# EAGLE schematic SparkFun_SARA-R5_Breakout (EAGLE 9.6.2)
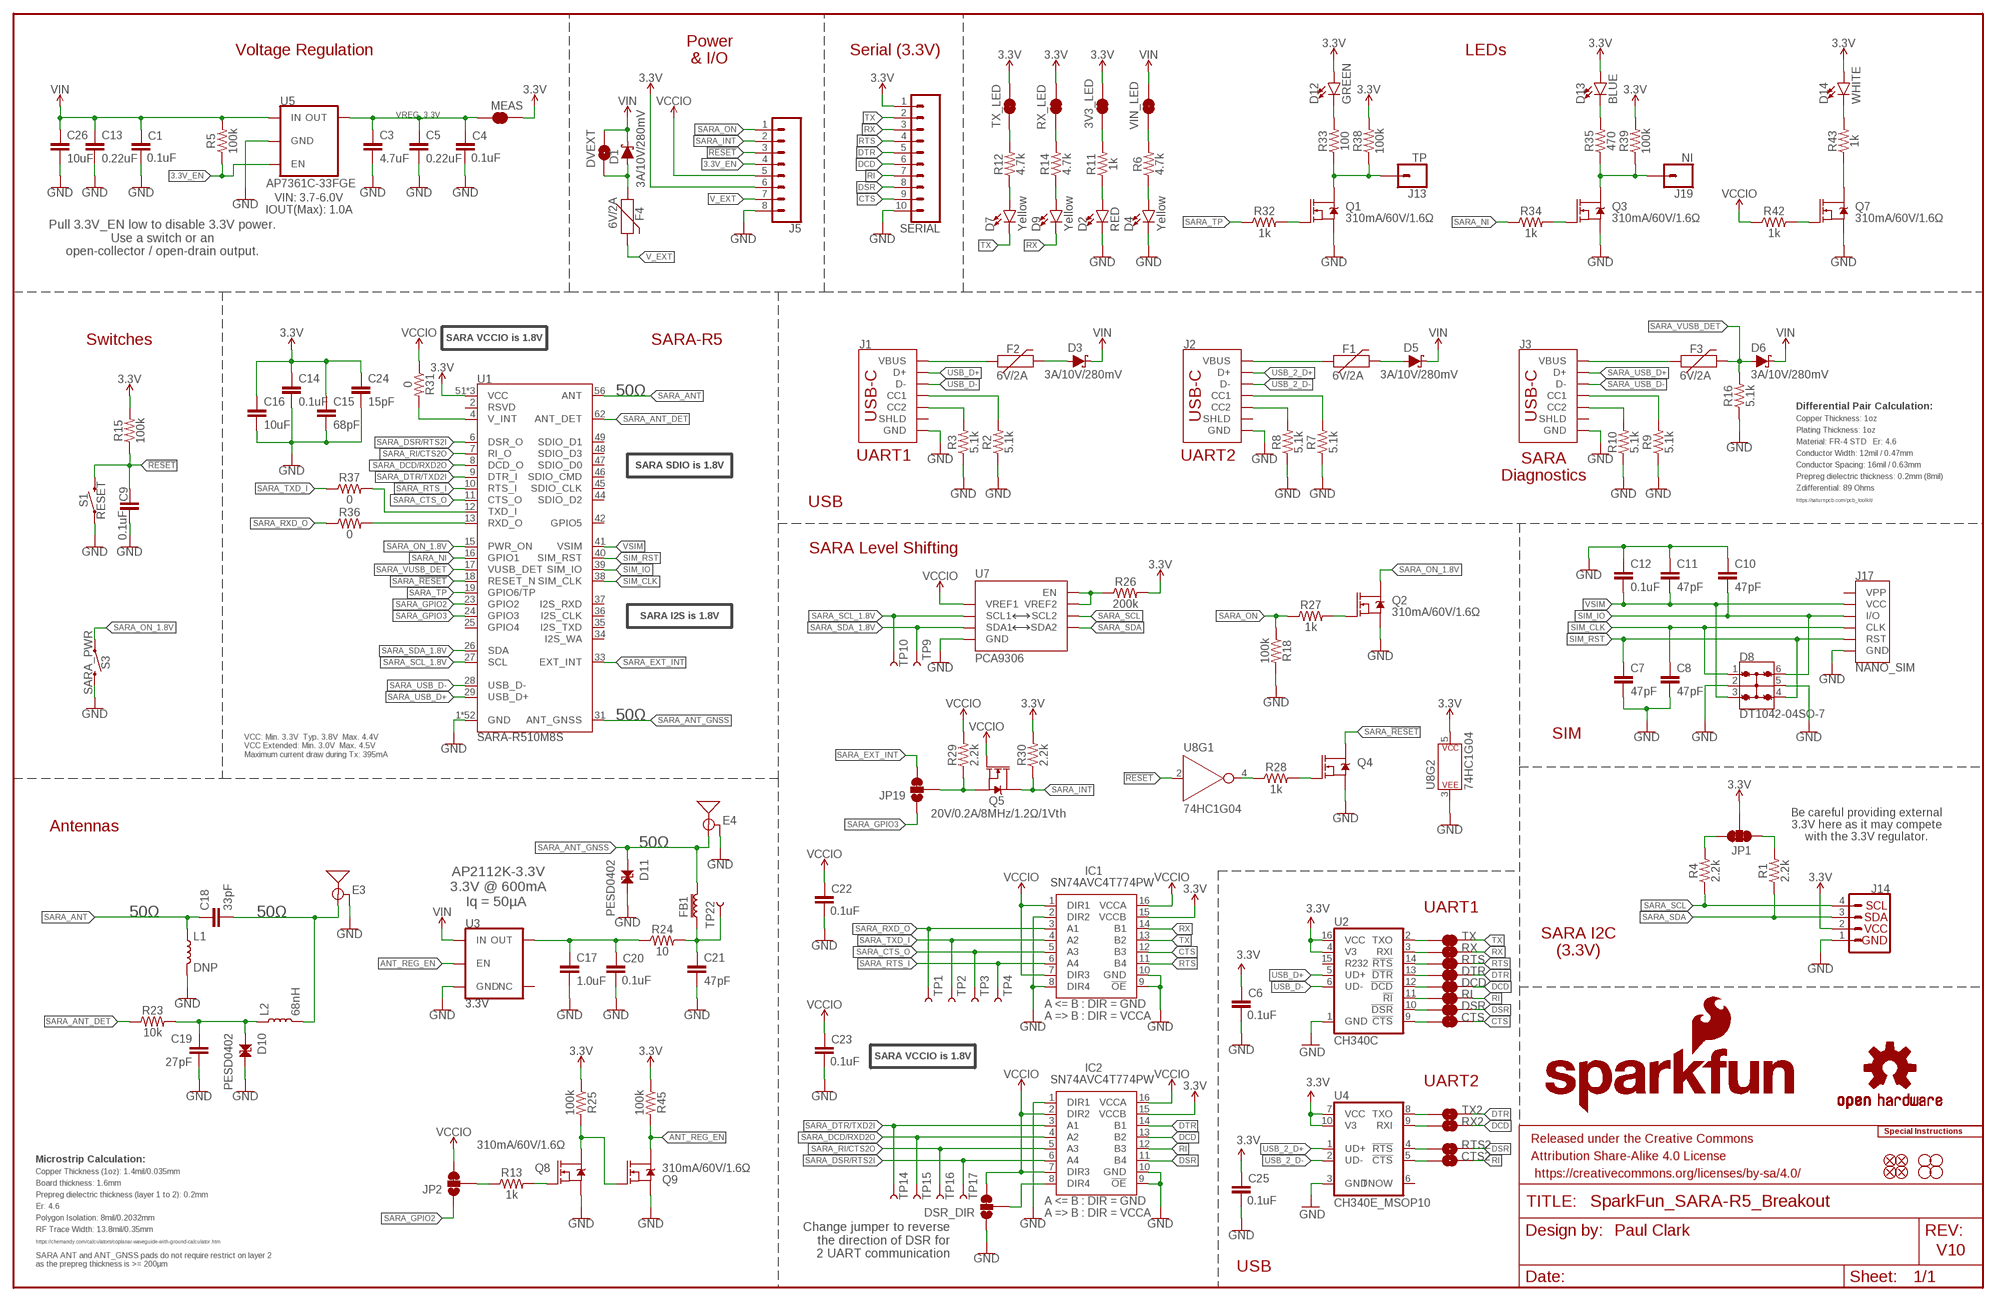
[diagram p0: schematic, sheet 1]

## Parts
3V3_LED  JUMPER-SMT_2_NC_TRACE_SILK  [SMT-JUMPER_2_NC_TRACE_SILK]
C1  0.1uF  0.1UF-0603-25V-5%  [0603]
C3  4.7uF  4.7UF-0603-6.3V-(10%)  [0603]
C4  0.1uF  0.1UF-0603-25V-5%  [0603]
C5  0.22uF  0.22UF-0603-25V-10%  [0603]
C6  0.1uF  0.1UF-0603-25V-5%  [0603]
C7  47pF  47PF-0603-50V-5%  [0603]
C8  47pF  47PF-0603-50V-5%  [0603]
C9  0.1uF  0.1UF-0603-25V-5%  [0603]
C10  47pF  47PF-0603-50V-5%  [0603]
C11  47pF  47PF-0603-50V-5%  [0603]
C12  0.1uF  0.1UF-0603-25V-5%  [0603]
C13  0.22uF  0.22UF-0603-25V-10%  [0603]
C14  0.1uF  0.1UF-0603-25V-5%  [0603]
C15  68pF  68PF-0603-50V-5%  [0603]
C16  10uF  10UF-0603-6.3V-20%  [0603]
C17  1.0uF  1.0UF-0603-16V-10%  [0603]
C18  33pF  33PF-0402-25V-5%-X7R  [0402]
C19  27pF  27PF-0402-25V-5%-X7R  [0402]
C20  0.1uF  0.1UF-0603-25V-5%  [0603]
C21  47pF  47PF-0603-50V-5%  [0603]
C22  0.1uF  0.1UF-0603-25V-5%  [0603]
C23  0.1uF  0.1UF-0603-25V-5%  [0603]
C24  15pF  15PF-0603-50V-5%  [0603]
C25  0.1uF  0.1UF-0603-25V-5%  [0603]
C26  10uF  10UF-0805-25V-10%  [0805]
CTS  JUMPER-SMT_2_NC_TRACE_SILK  [SMT-JUMPER_2_NC_TRACE_SILK]
CTS2  JUMPER-SMT_2_NO_SILK  [SMT-JUMPER_2_NO_SILK]
D1  3A/10V/280mV  DIODE-SCHOTTKY-BAT60A  [SOD-323]
D2  RED  LED-RED0603  [LED-0603]
D3  3A/10V/280mV  DIODE-SCHOTTKY-BAT60A  [SOD-323]
D4  Yellow  LED-YELLOW0603  [LED-0603]
D5  3A/10V/280mV  DIODE-SCHOTTKY-BAT60A  [SOD-323]
D6  3A/10V/280mV  DIODE-SCHOTTKY-BAT60A  [SOD-323]
D7  Yellow  LED-YELLOW0603  [LED-0603]
D8  DT1042-04SO-7  TVS_DIODE_ARRAY_4DT1042-04SO-7  [SOT23-6L]
D9  Yellow  LED-YELLOW0603  [LED-0603]
D10  PESD0402  [0402]
D11  PESD0402  [0402]
D12  GREEN  LED-GREEN0603  [LED-0603]
D13  BLUE  LED-BLUE0603  [LED-0603]
D14  WHITE  LED-WHITE0603  [LED-0603]
DCD  JUMPER-SMT_2_NC_TRACE_SILK  [SMT-JUMPER_2_NC_TRACE_SILK]
DSR  JUMPER-SMT_2_NC_TRACE_SILK  [SMT-JUMPER_2_NC_TRACE_SILK]
DSR_DIR  JUMPER-SMT_3_1-NC_TRACE_SILK  [SMT-JUMPER_3_1-NC_TRACE_SILK]
DTR  JUMPER-SMT_2_NC_TRACE_SILK  [SMT-JUMPER_2_NC_TRACE_SILK]
DVEXT  JUMPER-SMT_2_NO_SILK  [SMT-JUMPER_2_NO_SILK]
E3  ANTENNA-SMA-GROUNDEDEDGE_SMA_SMD  [SMA-EDGE-SMD]
E4  ANTENNA-SMA-GROUNDEDEDGE_SMA_SMD  [SMA-EDGE-SMD]
F1  6V/2A  PPTC_6V2A  [1210]
F2  6V/2A  PPTC_6V2A  [1210]
F3  6V/2A  PPTC_6V2A  [1210]
F4  6V/2A  PPTC_6V2A  [1210]
FB1  30Ω/1.8A  FERRITE_BEAD-0603  [0603]
FD1  FIDUCIALUFIDUCIAL  [FIDUCIAL-MICRO]
FD2  FIDUCIALUFIDUCIAL  [FIDUCIAL-MICRO]
FD3  FIDUCIALUFIDUCIAL  [FIDUCIAL-MICRO]
FD4  FIDUCIALUFIDUCIAL  [FIDUCIAL-MICRO]
FRAME1  FRAME-LEDGER  [CREATIVE_COMMONS]
H1  STAND-OFF  [STAND-OFF]
H2  STAND-OFF  [STAND-OFF]
H3  STAND-OFF  [STAND-OFF]
H4  STAND-OFF  [STAND-OFF]
IC1  SN74AVC4T774PW  [SOP65P640X120-16N]
IC2  SN74AVC4T774PW  [SOP65P640X120-16N]
J1  USB_C_4-LAYER_PADS  [USB-C-16P_4LAYER-PADS]
J2  USB_C_4-LAYER_PADS  [USB-C-16P_4LAYER-PADS]
J3  USB_C_4-LAYER_PADS  [USB-C-16P_4LAYER-PADS]
J5  CONN_08NO_SILK_DNP  [1X08_NO_SILK]
J13  TP  CONN_01PTH_NO_SILK_YES_STOP  [1X01_NO_SILK]
J14  I2C_STANDARD_NO_SILK  [1X04_NO_SILK]
J17  NANO_SIM  SIMHOLDERNANOSIM  [NANO_SIM_WURTH_693043020611]
J19  NI  CONN_01PTH_NO_SILK_YES_STOP  [1X01_NO_SILK]
JP1  JUMPER-SMT_3_2-NC_TRACE_SILK  [SMT-JUMPER_3_2-NC_TRACE_SILK]
JP2  JUMPER-SMT_3_1-NC_TRACE_SILK  [SMT-JUMPER_3_1-NC_TRACE_SILK]
JP19  JUMPER-SMT_3_1-NC_TRACE_SILK  [SMT-JUMPER_3_1-NC_TRACE_SILK]
L1  DNP  INDUCTOR_DNP-0402  [0402_COILCRAFT]
L2  68nH  68NH-0402  [0402_COILCRAFT]
LOGO1  SFE_LOGO_NAME_FLAME.1_INCH  [SFE_LOGO_NAME_FLAME_.1]
LOGO3  OSHW-LOGOMINI  [OSHW-LOGO-MINI]
LOGO5  SPECIAL_INSTRUCTIONS-ORDERING  [ORDERING_INSTRUCTIONS]
MEAS  JUMPER-COMBO_2_NC_TRACE  [COMBO-JUMPER_2_NC_TRACE]
Q1  310mA/60V/1.6Ω  MOSFET-NCH-2N7002PW  [SOT323]
Q2  310mA/60V/1.6Ω  MOSFET-NCH-2N7002PW  [SOT323]
Q3  310mA/60V/1.6Ω  MOSFET-NCH-2N7002PW  [SOT323]
Q4  310mA/60V/1.6Ω  MOSFET-NCH-2N7002PW  [SOT323]
Q5  20V/0.2A/8MHz/1.2Ω/1Vth  MOSFET-NCH-RE1C00UNTL  [SOT-416FL]
Q7  310mA/60V/1.6Ω  MOSFET-NCH-2N7002PW  [SOT323]
Q8  310mA/60V/1.6Ω  MOSFET-NCH-2N7002PW  [SOT323]
Q9  310mA/60V/1.6Ω  MOSFET-NCH-2N7002PW  [SOT323]
R1  2.2k  2.2KOHM-0603-1/10W-1%  [0603]
R2  5.1k  5.1KOHM5.1KOHM-0603-1/10W-1%  [0603]
R3  5.1k  5.1KOHM5.1KOHM-0603-1/10W-1%  [0603]
R4  2.2k  2.2KOHM-0603-1/10W-1%  [0603]
R5  100k  100KOHM-0603-1/10W-1%  [0603]
R6  4.7k  4.7KOHM-0603-1/10W-1%  [0603]
R7  5.1k  5.1KOHM5.1KOHM-0603-1/10W-1%  [0603]
R8  5.1k  5.1KOHM5.1KOHM-0603-1/10W-1%  [0603]
R9  5.1k  5.1KOHM5.1KOHM-0603-1/10W-1%  [0603]
R10  5.1k  5.1KOHM5.1KOHM-0603-1/10W-1%  [0603]
R11  1k  1KOHM-0603-1/10W-1%  [0603]
R12  4.7k  4.7KOHM-0603-1/10W-1%  [0603]
R13  1k  1KOHM-0603-1/10W-1%  [0603]
R14  4.7k  4.7KOHM-0603-1/10W-1%  [0603]
R15  100k  100KOHM-0603-1/10W-1%  [0603]
R16  5.1k  5.1KOHM5.1KOHM-0603-1/10W-1%  [0603]
R18  100k  100KOHM-0603-1/10W-1%  [0603]
R23  10k  10KOHM-0603-1/10W-1%  [0603]
R24  10  10OHM-0603-1/10W-1%  [0603]
R25  100k  100KOHM-0603-1/10W-1%  [0603]
R26  200k  200KOHM-0603-1/10W-1%  [0603]
R27  1k  1KOHM-0603-1/10W-1%  [0603]
R28  1k  1KOHM-0603-1/10W-1%  [0603]
R29  2.2k  2.2KOHM-0603-1/10W-1%  [0603]
R30  2.2k  2.2KOHM-0603-1/10W-1%  [0603]
R31  0  0OHM-0603-1/10W  [0603]
R32  1k  1KOHM-0603-1/10W-1%  [0603]
R33  100  100OHM-0603-1/10W-1%  [0603]
R34  1k  1KOHM-0603-1/10W-1%  [0603]
R35  470  470OHM-0603-1/10W-1%  [0603]
R36  0  0OHM-0603-1/10W  [0603]
R37  0  0OHM-0603-1/10W  [0603]
R38  100k  100KOHM-0603-1/10W-1%  [0603]
R39  100k  100KOHM-0603-1/10W-1%  [0603]
R42  1k  1KOHM-0603-1/10W-1%  [0603]
R43  1k  1KOHM-0603-1/10W-1%  [0603]
R45  100k  100KOHM-0603-1/10W-1%  [0603]
RI  JUMPER-SMT_2_NC_TRACE_SILK  [SMT-JUMPER_2_NC_TRACE_SILK]
RTS  JUMPER-SMT_2_NC_TRACE_SILK  [SMT-JUMPER_2_NC_TRACE_SILK]
RTS2  JUMPER-SMT_2_NO_SILK  [SMT-JUMPER_2_NO_SILK]
RX  JUMPER-SMT_2_NC_TRACE_SILK  [SMT-JUMPER_2_NC_TRACE_SILK]
RX2  JUMPER-SMT_2_NO_SILK  [SMT-JUMPER_2_NO_SILK]
RX_LED  JUMPER-SMT_2_NC_TRACE_SILK  [SMT-JUMPER_2_NC_TRACE_SILK]
S1  RESET  MOMENTARY-SWITCH-SPST-SMD-5.2-TALL-REDUNDANT  [TACTILE_SWITCH_SMD_5.2MM]
S3  SARA_PWR  MOMENTARY-SWITCH-SPST-SMD-5.2-TALL-REDUNDANT  [TACTILE_SWITCH_SMD_5.2MM]
SERIAL  CONN_10NO_SILK_PTH_FEMALE  [1X10_NO_SILK]
TP1  TEST-POINT3  [PAD.03X.03]
TP2  TEST-POINT3  [PAD.03X.03]
TP3  TEST-POINT3  [PAD.03X.03]
TP4  TEST-POINT3  [PAD.03X.03]
TP9  TEST-POINT3  [PAD.03X.03]
TP10  TEST-POINT3  [PAD.03X.03]
TP14  TEST-POINT3  [PAD.03X.03]
TP15  TEST-POINT3  [PAD.03X.03]
TP16  TEST-POINT3  [PAD.03X.03]
TP17  TEST-POINT3  [PAD.03X.03]
TP22  TEST-POINT3  [PAD.03X.03]
TX  JUMPER-SMT_2_NC_TRACE_SILK  [SMT-JUMPER_2_NC_TRACE_SILK]
TX2  JUMPER-SMT_2_NO_SILK  [SMT-JUMPER_2_NO_SILK]
TX_LED  JUMPER-SMT_2_NC_TRACE_SILK  [SMT-JUMPER_2_NC_TRACE_SILK]
U1  SARA-R510M8S  [SARA-LGA]
U2  CH340C  [SO016]
U3  3.3V  V_REG_AP2112K-3.3V  [SOT23-5]
U4  CH340E_MSOP10  [MSOP10]
U5  AP7361C-33FGE  AP7361C-33FGEUDFN-8  [UDFN-8]
U7  PCA9306  PCA9306VSSOP_8PIN  [VSSOP_8PIN]
U8  74HC1G04  [SOT353]
VIN_LED  JUMPER-SMT_2_NC_TRACE_SILK  [SMT-JUMPER_2_NC_TRACE_SILK]

## Nets
3.3V: 3V3_LED.2 C6.1 C14.1 C15.1 C16.1 C24.1 C25.1 D12.A D13.A D14.A IC1.15(VCCB) IC2.15(VCCB) J5.6 J14.2 JP1.2 MEAS.2 MEAS.4 R15.2 R25.1 R26.2 R30.2 R38.2 R39.2 R45.1 RX_LED.2 SERIAL.1 TX_LED.2 U1.51(VCC) U1.52(VCC) U1.53(VCC) U2.4(V3) U2.16(VCC) U4.7(VCC) U4.10(V3) U8.5(P$V+)
3.3V_EN: J5.4 R5.1 U5.5(EN)
!RESET!: C9.1 J5.3 R15.1 S1.3 S1.4 U8.2(A)
ANT_REG_EN: Q9.3(D) R45.2 U3.3(EN)
CTS: CTS.2 IC1.12(B3) SERIAL.9
DCD: DCD.2 IC2.13(B2) RX2.2 SERIAL.6
DSR: DSR.2 IC2.11(B4) RTS2.2 SERIAL.8
DTR: DTR.2 IC2.14(B1) SERIAL.5 TX2.2
GND: C1.2 C3.2 C4.2 C5.2 C6.2 C7.2 C8.2 C9.2 C10.1 C11.1 C12.1 C13.2 C14.2 C15.2 C16.2 C17.2 C19.2 C20.2 C21.2 C22.2 C23.2 C24.2 C25.2 C26.2 D2.C D4.C D8.2 D8.5 D10.2 D11.2 DSR_DIR.1 E3.GND@0(GND) E3.GND@1(GND) E4.GND@0(GND) E4.GND@1(GND) IC1.2(DIR2) IC1.8(DIR4) IC1.9(!OE) IC1.10(GND) IC2.1(DIR1) IC2.9(!OE) IC2.10(GND) J1.GND J1.GND2(GND) J2.GND J2.GND2(GND) J3.GND J3.GND2(GND) J5.8 J14.1 J17.C5(GND) L1.P$2 Q1.2(S) Q2.2(S) Q3.2(S) Q4.2(S) Q7.2(S) Q8.2(S) Q9.2(S) R2.1 R3.1 R7.1 R8.1 R9.1 R10.1 R16.1 R18.2 S1.1 S1.2 S3.3 S3.4 SERIAL.10 U1.1(GND) U1.3(GND) U1.5(GND) U1.14(GND) U1.20(GND) U1.21(GND) U1.22(GND) U1.30(GND) U1.32(GND) U1.43(GND) U1.50(GND) U1.54(GND) U1.55(GND) U1.57(GND) U1.58(GND) U1.59(GND) U1.60(GND) U1.61(GND) U1.63(GND) U1.64(GND) U1.65(GND) U1.66(GND) U1.67(GND) U1.68(GND) U1.69(GND) U1.70(GND) U1.71(GND) U1.72(GND) U1.73(GND) U1.74(GND) U1.75(GND) U1.76(GND) U1.77(GND) U1.78(GND) U1.79(GND) U1.80(GND) U1.81(GND) U1.82(GND) U1.83(GND) U1.84(GND) U1.85(GND) U1.86(GND) U1.87(GND) U1.88(GND) U1.89(GND) U1.90(GND) U1.91(GND) U1.92(GND) U1.93(GND) U1.94(GND) U1.95(GND) U1.96(GND) U2.1(GND) U3.2(GND) U4.3(GND) U5.4(GND) U5.EP(GND) U7.P1(GND) U8.3(P$V-)
N$1: R6.2 VIN_LED.1
N$2: JP1.3 R4.2
N$3: JP1.1 R1.2
N$4: D3.A F2.2
N$5: J2.A5(CC1) R7.2
N$6: 3V3_LED.1 R11.2
N$7: D2.A R11.1
N$8: D4.A R6.1
N$9: J2.B5(CC2) R8.2
N$10: J1.A5(CC1) R2.2
N$11: J1.B5(CC2) R3.2
N$12: D5.A F1.2
N$13: F1.1 J2.VBUS1(VBUS) J2.VBUS2(VBUS)
N$14: J3.A5(CC1) R9.2
N$15: C18.2 E3.SIG(SIGNAL) L2.P$2
N$16: C19.1 D10.1 L2.P$1 R23.2
N$17: J3.B5(CC2) R10.2
N$18: F3.1 J3.VBUS1(VBUS) J3.VBUS2(VBUS)
N$19: F2.1 J1.VBUS1(VBUS) J1.VBUS2(VBUS)
N$20: TX.1 U2.2(TXO)
N$21: RX.1 U2.3(RXI)
N$22: R26.1 U7.P7(VREF2) U7.P8(EN)
N$23: DSR_DIR.2 IC2.8(DIR4)
N$24: C17.1 C20.1 R24.1 U3.5(OUT)
N$25: C21.1 FB1.1 R24.2 TP22.P$1
N$26: Q2.1(G) R27.2
N$27: Q4.1(G) R28.2
N$28: R28.1 U8.4(Y)
N$29: RTS.1 U2.14(!RTS)
N$30: DTR.1 U2.13(!DTR)
N$31: R31.2 U1.4(V_INT)
N$32: Q1.1(G) R32.2
N$33: J13.1 Q1.3(D) R33.1 R38.1
N$34: D12.C R33.2
N$35: Q3.1(G) R34.2
N$36: J19.1 Q3.3(D) R35.1 R39.1
N$37: D13.C R35.2
N$38: R36.2 U1.13(RXD_O)
N$39: R37.2 U1.12(TXD_I)
N$40: Q8.1(G) R13.2
N$41: DCD.1 U2.12(!DCD)
N$42: Q8.3(D) Q9.1(G) R25.2
N$43: JP19.2 Q5.2(S) R29.1
N$44: RI.1 U2.11(!RI)
N$45: DSR.1 U2.10(!DSR)
N$46: CTS.1 U2.9(!CTS)
N$47: Q7.1(G) R42.2
N$48: TX2.1 U4.8(TXO)
N$49: D14.C R43.2
N$50: RX2.1 U4.9(RXI)
N$51: RTS2.1 U4.4(!RTS)
N$52: CTS2.1 U4.5(!CTS)
N$53: R12.2 TX_LED.1
N$54: D7.A R12.1
N$55: R14.2 RX_LED.1
N$56: D9.A R14.1
N$57: D1.A DVEXT.1 F4.1
N$58: JP2.2 R13.1
RI: CTS2.2 IC2.12(B3) RI.2 SERIAL.7
RTS: IC1.11(B4) RTS.2 SERIAL.4
RX: D9.C IC1.14(B1) RX.2 SERIAL.3
SARA_!ON!: Q7.3(D) R43.1
SARA_!RESET!: Q4.3(D) U1.18(RESET_N)
SARA_ANT: C18.1 L1.P$1 U1.56(ANT)
SARA_ANT_DET: R23.1 U1.62(ANT_DET)
SARA_ANT_GNSS: D11.1 E4.SIG(SIGNAL) FB1.2 U1.31(ANT_GNSS)
SARA_CTS_O: IC1.5(A3) TP3.P$1 U1.11(CTS_O)
SARA_DCD/RXD2O: IC2.4(A2) TP15.P$1 U1.8(DCD_O)
SARA_DSR/RTS2I: IC2.6(A4) TP17.P$1 U1.6(DSR_O)
SARA_DTR/TXD2I: IC2.3(A1) TP14.P$1 U1.9(DTR_I)
SARA_EXT_INT: JP19.3 U1.33(EXT_INT)
SARA_GPIO2: JP2.1 U1.23(GPIO2)
SARA_GPIO3: JP19.1 U1.24(GPIO3)
SARA_INT: J5.2 Q5.3(D) R30.1
SARA_NI: R34.1 U1.16(GPIO1)
SARA_ON: J5.1 R18.1 R27.1
SARA_ON_1.8V: Q2.3(D) S3.1 S3.2 U1.15(PWR_ON)
SARA_RI/CTS2O: IC2.5(A3) TP16.P$1 U1.7(RI_O)
SARA_RTS_I: IC1.6(A4) TP4.P$1 U1.10(RTS_I)
SARA_RXD_O: IC1.3(A1) R36.1 TP1.P$1
SARA_SCL: J14.4 R4.1 U7.P6(SCL2)
SARA_SCL_1.8V: TP10.P$1 U1.27(SCL) U7.P3(SCL1)
SARA_SDA: J14.3 R1.1 U7.P5(SDA2)
SARA_SDA_1.8V: TP9.P$1 U1.26(SDA) U7.P4(SDA1)
SARA_TP: R32.1 U1.19(GPIO6/TP)
SARA_TXD_I: IC1.4(A2) R37.1 TP2.P$1
SARA_USB_D+: J3.A6(D+) J3.B6(D+) U1.29(USB_D+)
SARA_USB_D-: J3.A7(D-) J3.B7(D-) U1.28(USB_D-)
SARA_VUSB_DET: D6.A F3.2 R16.2 U1.17(VUSB_DET)
SIM_CLK: C8.1 D8.1 J17.C3(CLK) U1.38(SIM_CLK)
SIM_IO: C10.2 D8.6 J17.C7(I/O) U1.39(SIM_IO)
SIM_RST: C7.1 D8.4 J17.C2(RST) U1.40(SIM_RST)
TX: D7.C IC1.13(B2) SERIAL.2 TX.2
USB_2_D+: J2.A6(D+) J2.B6(D+) U4.1(UD+)
USB_2_D-: J2.A7(D-) J2.B7(D-) U4.2(UD-)
USB_D+: J1.A6(D+) J1.B6(D+) U2.5(UD+)
USB_D-: J1.A7(D-) J1.B7(D-) U2.6(UD-)
V_EXT: F4.2 J5.7
VCCIO: C22.1 C23.1 DSR_DIR.3 IC1.1(DIR1) IC1.7(DIR3) IC1.16(VCCA) IC2.2(DIR2) IC2.7(DIR3) IC2.16(VCCA) J5.5 JP2.3 Q5.1(G) R29.2 R31.1 R42.1 U7.P2(VREF1)
VIN: C1.1 C13.1 C26.1 D1.C D3.C D5.C D6.C DVEXT.2 R5.2 U3.1(IN) U5.8(IN) VIN_LED.2
VREG_3.3V: C3.1 C4.1 C5.1 MEAS.1 MEAS.3 U5.1(OUT)
VSIM: C11.2 C12.2 D8.3 J17.C1(VCC) U1.41(VSIM)
Unconnected: J1.SHLD1(SHLD) J1.SHLD2(SHLD) J1.SHLD3(SHLD) J1.SHLD4(SHLD) J2.SHLD1(SHLD) J2.SHLD2(SHLD) J2.SHLD3(SHLD) J2.SHLD4(SHLD) J3.SHLD1(SHLD) J3.SHLD2(SHLD) J3.SHLD3(SHLD) J3.SHLD4(SHLD) J17.C6(VPP) U1.2(RSVD) U1.25(GPIO4) U1.34(I2S_WA) U1.35(I2S_TXD) U1.36(I2S_CLK) U1.37(I2S_RXD) U1.42(GPIO5) U1.44(SDIO_D2) U1.45(SDIO_CLK) U1.46(SDIO_CMD) U1.47(SDIO_D0) U1.48(SDIO_D3) U1.49(SDIO_D1) U2.15(R232) U3.4(NC) U4.6(TNOW)

## Notes on the sheet
- Voltage Regulation
- Power
  & I/O
- Serial (3.3V) | LEDs
- VIN: 3.7-6.0V
  IOUT(Max): 1.0A
- Pull 3.3V_EN low to disable 3.3V power.
  Use a switch or an
  open-collector / open-drain output.
- SARA VCCIO is 1.8V
- Switches | SARA-R5
- 50Ω
- Differential Pair Calculation:
- Copper Thickness: 1oz
- Plating Thickness: 1oz
- Material: FR-4 STD   Er: 4.6
- UART1 | UART2 | Conductor Width: 12mil / 0.47mm
- SARA SDIO is 1.8V
- SARA
  Diagnostics
- Conductor Spacing: 16mil / 0.63mm
- Prepreg dielectric thickness: 0.2mm (8mil)
- Zdifferential: 89 Ohms
- USB | https://saturnpcb.com/pcb_toolkit/
- SARA Level Shifting
- SARA I2S is 1.8V
- 50Ω
- SIM
- VCC: Min. 3.3V  Typ. 3.8V  Max. 4.4V
  VCC Extended: Min. 3.0V  Max. 4.5V
  Maximum current draw during Tx: 395mA
- Be careful providing external
  3.3V here as it may compete
  with the 3.3V regulator.
- Antennas
- 50Ω
- AP2112K-3.3V
  3.3V @ 600mA
  Iq = 50µA
- UART1
- 50Ω | 50Ω
- SARA I2C
  (3.3V)
- SARA VCCIO is 1.8V
- UART2
- Microstrip Calculation:
- Copper Thickness (1oz): 1.4mil/0.035mm
- Board thickness: 1.6mm
- Prepreg dielectric thickness (layer 1 to 2): 0.2mm
- Er: 4.6
- Polygon Isolation: 8mil/0.2032mm
- Change jumper to reverse
  the direction of DSR for
  2 UART communication
- RF Trace Width: 13.8mil/0.35mm
- Paul Clark
- https://chemandy.com/calculators/coplanar-waveguide-with-ground-calculator.htm
- V10
- USB
- SARA ANT and ANT_GNSS pads do not require restrict on layer 2
  as the prepreg thickness is >= 200µm

## Library data of the parts
3V3_LED CTS DCD DSR DTR RI RTS RX RX_LED TX TX_LED VIN_LED = SparkFun-Jumpers:JUMPER-SMT_2_NC_TRACE: Normally closed trace jumper This jumper has a trace between two pads so it's normally closed (NC). Use a razor knife to open the connection. For best results follow the IPC guidelines for cutting traces: Cutout at least 0.063 mm (0.005 in). Remove all loose material to clean up the cut area. Seal the cut with an approved epoxy. Reapply solder to reclose the connection.
C1 C4 C6 C9 C12 C14 C20 C22 C23 C25 = SparkFun-Capacitors:0.1UF: 0.1µF ceramic capacitors A capacitor is a passive two-terminal electrical component used to store electrical energy temporarily in an electric field.; PROD_ID: CAP-08604
C3 = SparkFun-Capacitors:4.7UF: 4.7µF ceramic capacitors A capacitor is a passive two-terminal electrical component used to store electrical energy temporarily in an electric field.; PROD_ID: CAP-08280
C5 C13 = SparkFun-Capacitors:0.22UF: 0.22µF ceramic capacitors A capacitor is a passive two-terminal electrical component used to store electrical energy temporarily in an electric field.; PROD_ID: CAP-07822
C7 C8 C10 C11 C21 = SparkFun-Capacitors:47PF: 47pF ceramic capacitors A capacitor is a passive two-terminal electrical component used to store electrical energy temporarily in an electric field.; PROD_ID: CAP-08913
C15 = SparkFun-Capacitors:68PF: 68pF ceramic capacitors A capacitor is a passive two-terminal electrical component used to store electrical energy temporarily in an electric field.; PROD_ID: CAP-14092
C16 = SparkFun-Capacitors:10UF: 10.0µF ceramic capacitors A capacitor is a passive two-terminal electrical component used to store electrical energy temporarily in an electric field.; PROD_ID: CAP-11015
C17 = SparkFun-Capacitors:1.0UF: 1µF ceramic capacitors A capacitor is a passive two-terminal electrical component used to store electrical energy temporarily in an electric field.; PROD_ID: CAP-00868
C18 = New_Parts:33PF: 33pF ceramic capacitors A capacitor is a passive two-terminal electrical component used to store electrical energy temporarily in an electric field.; DIGIKEY_PART: 490-5936-1-ND; MANUFACTURER: Murata; MANU_PART: GRM1555C1H330JA; PROD_ID: CAP-15358
C19 = New_Parts:27PF: 27pF ceramic capacitors A capacitor is a passive two-terminal electrical component used to store electrical energy temporarily in an electric field.; DIGIKEY_PART: 490-11384-1-ND; MANUFACTURER: Murata; MANU_PART: GRM1555C1H270JA; PROD_ID: CAP-15357
C24 = SparkFun-Capacitors:15PF: 15pF ceramic capacitors A capacitor is a passive two-terminal electrical component used to store electrical energy temporarily in an electric field.; PROD_ID: CAP-07881
C26 = SparkFun-Capacitors:10UF: 10.0µF ceramic capacitors A capacitor is a passive two-terminal electrical component used to store electrical energy temporarily in an electric field.; PROD_ID: CAP-14259
CTS2 DVEXT RTS2 RX2 TX2 = SparkFun-Jumpers:JUMPER-SMT_2_NO: Normally open jumper This jumper has two pads in close proximity to each other. Apply solder to close the connection. Round pads are easier to solder for beginners, but are a lot larger. SparkFun Product that uses the round pads: SparkFun EL Sequencer <https://www.sparkfun.com/products/12781>
D1 D3 D5 D6 = SparkFun-DiscreteSemi:DIODE-SCHOTTKY: Schottky diode A Schottky diode is a semiconductor diode which has a low forward voltage drop and a very fast switching action.; PROD_ID: DIO-14072
D2 = SparkFun-LED:LED-RED: Red SMD LED Used in manufacturing of most products at SparkFun Packages: 0603 - SMD 0603 package [Product Link] <http://docs.avagotech.com/docs/AV02-0551EN> 0603 SMART - SMD 0603 SMART package ( more efficient and expensive)[Product Link] <http://www.osram-os.com/Graphics/XPic2/00077099_0.pdf> 1206 - SMD1206 package [Product Link] <https://www.sparkfun.com/datasheets/DevTools/LilyPad/Q150OVS4.pdff> SparkFun Products: Pro Mini 328 -5V <https://www.sparkfun.com/products/821> RedBoard <https://www.sparkfun.com/products/12757> IOIO-OTG <https://www.sparkfun.com/products/13613>; PROD_ID: DIO-00819
D4 D7 D9 = SparkFun-LED:LED-YELLOW: Yellow SMD LED Used in manufacturing several products at SparkFun. Packages: 0603 - SMD 0603 package[Product Link] <http://www.kingbrightusa.com/product.asp?catalog_name=LED&product_id=APT1608SYCK> 0603 -SMART - SMART SMD 0603 package (more efficient/more expensive) [Product Link] <http://www.osram-os.com/osram_os/en/products/product-catalog/led-light-emitting-diodes/smartled-0603/ly-l29k/index.jsp> LilyPad - SMD1206 package[Product Datasheet] <https://www.sparkfun.com/datasheets/DevTools/LilyPad/Q150YUS4.pdf> SparkFun Products: Blynk Board <https://www.sparkfun.com/products/13794> IOIO-OTG <https://www.sparkfun.com/products/13613> XBee Explorer Serial <https://www.sparkfun.com/products/13225>; PROD_ID: DIO-09003
D8 = SparkFun-DiscreteSemi:TVS_DIODE_ARRAY_4; PROD_ID: DIO-14095
D10 D11 = New_Parts:PESD0402: ESD protection diode PESD is used to protect a signal line from ESD.; DIGIKEY_PART: PESD0402-140CT-ND; MOUSE_PART: 650-PESD0402-140; PROD_ID: DIO-15359
D12 = SparkFun-LED:LED-GREEN: Green SMD LED Used in manufacturing of various products at SparkFun Packages: 0603 - SMD 0603 package [Product Link] <http://www.futureelectronics.com/en/technologies/semiconductors/optoelectronics/leds/Pages/9894312-LTST-C190GKT.aspx?CrossPart=HSMG-C190&IM=0> LilyPad 1206 - SMD1206 LilyPad package [Product Link] <http://www.futureelectronics.com/en/Technologies/Product.aspx?ProductID=IN150NGHARVATEKCORPORATION2049943&IM=0> 1206 - SMD1206 package [Product Link] <http://www.futureelectronics.com/en/technologies/semiconductors/optoelectronics/leds/Pages/8315665-LTST-C150KGKT.aspx?IM=0> 1206 Bottom Mount -SMD 1206 Bottom Mount [Product Link] <http://www.digikey.com/product-detail/en/lite-on-inc/LTST-C230KGKT/160-1456-1-ND/386854> SparkFun Products: Pro Mini 328 -5V <https://www.sparkfun.com/products/821> RedBoard <https://www.sparkfun.com/products/12757> MP3 Trigger <https://www.sparkfun.com/products/13720> Makey Makey <https://www.sparkfun.com/products/11076>; PROD_ID: DIO-00821
D13 = SparkFun-LED:LED-BLUE: Blue SMD LED Used in manufacturing of various products at SparkFun Packages: 0603 - SMD 0603 package [Product Link] <http://www.digikey.com/product-detail/en/SMLE12BC7TT86/511-1589-2-ND/1641808> 1206 - SMD1206 package [Product Link] <http://www.digikey.com/product-detail/en/lite-on-inc/LTST-C150TBKT/160-1643-1-ND/573584> SparkFun Products: ESP8266 Thing-Dev Board <https://www.sparkfun.com/products/13711> RedBoard <https://www.sparkfun.com/products/12757>; PROD_ID: DIO-08575
D14 = SparkFun-LED:LED-WHITE: White SMD LED Used in manufacturing several products at SparkFun. Packages: 0603 - Bright White SMD 0603 package[Product Link] <http://www.kingbrightusa.com/product.asp?catalog_name=LED&product_id=APT1608QWF/D> 1206 - Bright White SMD1206 package [Product Link] <http://www.kingbrightusa.com/product.asp?catalog_name=LED&product_id=APT3216QWF/D> 3014 - Super Bright SMD 3014 package [Datasheet] <http://www.lumileds.com/uploads/459/DS208-pdf> SparkFun Products: Blackberry Trackballer Breakout <https://www.sparkfun.com/products/13169> Digital SandBox <https://www.sparkfun.com/products/12651>; PROD_ID: DIO-09004
DSR_DIR JP2 JP19 = SparkFun-Jumpers:JUMPER-SMT_3_1-NC_TRACE: Normally closed trace jumper (1 of 2 connections) This jumper has a trace between two pads so it's normally closed (NC). The other connection is normally open (NO). Use a razor knife to open the connection. For best results follow the IPC guidelines for cutting traces: Cutout at least 0.063 mm (0.005 in). Remove all loose material to clean up the cut area. Seal the cut with an approved epoxy. Reapply solder to reclose the connection, or to close the NO connection.
E3 E4 = SparkFun-RF:ANTENNA-SMA-GROUNDED: SMA Antenna Connector w/ Ground Edge-mount and SMD SMA connectors for RF Antennas. **4-LAYER BOARD WARNING!!** When designing a 4-layer board using any of the SMD variants, you will need to manually add a cutout polygon on any internal power layers to make sure that you don't end up with exposed copper around the edge of the routed hole for these connectors. Exposed power copper could then short to the connector body - and that would be bad. Why hasn't anyone added the cutout polygons directly to the connector footprint? Well, your internal layers (usually 2 and 15) may be covered with GND polygons and you might well want the copper to go all the way to the edge, especially under the connector SIGNAL pin. So adding cutouts to the footprint might make matters worse, not better...; PROD_ID: CONN-15100
F1-F4 = SparkFun-Fuses:PPTC: Resettable Fuse PPTC Resettable Fuse. Really a sort of resistor with a polymeric positive temperature coefficient whose resistance increases dramatically with an increase in temperature. When heated by the power passing through the resistance rises causing the current to be limited, protecting the circuit. This is achieved by the transition of the polymer from a crystalline to an amorphous state where the conductive carbon separates breaking the conductive pathways found in the cool crystalline structure. When a PPTC cools back down it resumes conducting letting the circuit turn back on. SparkFun Products: SparkFun RedBoard - Programmed with Arduino <https://www.sparkfun.com/products/12757> Pro Micro - 5V/16MHz <https://www.sparkfun.com/products/12640> Arduino Pro 328 - 5V/16MHz <https://www.sparkfun.com/products/10915> MP3 Trigger <https://www.sparkfun.com/products/13720>; PROD_ID: RES-14313
FB1 = SparkFun-Coils:FERRITE_BEAD: Ferrite Bead (blocks, cores, rings, chokes, etc.) Inductor with layers of ferrite used to suppress high frequencies. Often used to isolate high frequency noise. SparkFun Products: IOIO-OTG - V2.2 <https://www.sparkfun.com/products/13613> SparkFun SAMD21 Mini Breakout <https://www.sparkfun.com/products/13664> SparkFun 6 Degrees of Freedom Breakout - LSM6DS3 <https://www.sparkfun.com/products/13339> SparkFun SAMD21 Dev Breakout <https://www.sparkfun.com/products/13672>; PROD_ID: NDUC-13805
FD1-FD4 = SparkFun-Aesthetics:FIDUCIAL: Fiducial Alignment Points Point-of-reference for pick-and-place machines and other optical instruments.
FRAME1 = SparkFun-Aesthetics:FRAME-LEDGER: Schematic Frame - Ledger Standard 11x14 US Ledger frame
H1-H4 = SparkFun-Hardware:STAND-OFF: Stand Off Drill holes for mechanically mounting via screws, standoffs, etc. Note: Use the keepout ring to avoid running the screw head into surrounding components. Variant Overviews STAND-OFF - Mechanical footprint for a #4 phillips button head screw. STAND-OFF-TIGHT - Mechanical footprint for a #4 phillips button head screw, Example SparkFun Products Screw - Phillips Head (1/4", 4-40, 10 pack) <https://www.sparkfun.com/products/10453> (PRT-10453) Screw - Phillips Head (1/2", 4-40, 10 pack) <https://www.sparkfun.com/products/10452> (PRT-10452) Screw - Phillips Head (3/4", 4-40, 10 pack) <https://www.sparkfun.com/products/10451> (PRT-10451) Screw - Phillips Head (1", 4-40, 10 pack) <https://www.sparkfun.com/products/10450> (PRT-10450)
IC1 IC2 = New_Parts:SN74AVC4T774PW: Texas Instruments,SN74AVC4T774PW,IC, Texas Instruments SN74AVC4T774PW, Dual, Bus Transceiver, 4-Bit Non-Inverting 3-State, 1.2 3.6 V, 16-Pin TSSOP Source: Datasheet <http://www.ti.com/lit/ds/symlink/sn74avc4t774.pdf>; ARROW_PART_NUMBER: SN74AVC4T774PW; ARROW_PRICE-STOCK: https://www.arrow.com/en/products/sn74avc4t774pw/texas-instruments; DESCRIPTION: Texas Instruments,SN74AVC4T774PW,IC, Texas Instruments SN74AVC4T774PW, Dual, Bus Transceiver, 4-Bit Non-Inverting 3-State, 1.2 3.6 V, 16-Pin TSSOP; MANUFACTURER_NAME: Texas Instruments; MANUFACTURER_PART_NUMBER: SN74AVC4T774PW; MOUSER_PART_NUMBER: 595-SN74AVC4T774PW; MOUSER_PRICE-STOCK: https://www.mouser.co.uk/ProductDetail/Texas-Instruments/SN74AVC4T774PW?qs=WxL8HmPi5r44hV1AE7gRvg%3D%3D; PROD_ID: IC-15360
J1-J3 = SparkFun-Connectors:USB_C: USB Type C 16Pin Connector Super Speed pins not available on the 16-pin purely SMD connector so this part is best for USB 2.0 implementations. D1 and D2 are tied together enabling D+/- no matter which way the cable is plugged into the connector. The two channel configuration pins (CC1/2) are exposed. These are normally connected to ground via 5.1k resistors but can be reconfigured for high current/high power applications. **4-LAYER BOARD WARNING!!** If designing 4-layer board, make sure to select the variant _4-LAYER-ISOLATED. The linked footprint (USB-C-16-4LAYER-ISOLATED) includes some very necessary cutout polygons in the inner layers (2 and 15). This prevents the PTH mounting shield legs on the USB connector from electrically connecting any other polygons on the inner layers (usually VCC and GND).; PROD_ID: CONN-14122
J5 = SparkFun-Connectors:CONN_08: Multi connection point. Often used as Generic Header-pin footprint for 0.1 inch spaced/style header connections On any of the 0.1 inch spaced packages, you can populate with these: Break Away Headers - Straight <https://www.sparkfun.com/products/116> (PRT-00116) Break Away Male Headers - Right Angle <https://www.sparkfun.com/products/553> (PRT-00553) Female Headers <https://www.sparkfun.com/products/115> (PRT-00115) Break Away Headers - Machine Pin <https://www.sparkfun.com/products/117> (PRT-00117) Break Away Female Headers - Swiss Machine Pin <https://www.sparkfun.com/products/743> (PRT-00743) Arduino Stackable Header - 8 Pin <https://www.sparkfun.com/products/9279> (PRT-09279) For SCREWTERMINALS and SPRING TERMINALS visit here: Screw Terimnals on SparkFun.com <https://www.sparkfun.com/search/results?term=Screw+Terminals> (5mm/3.5mm/2.54mm spacing) This device is also useful as a general connection point to wire up your design to another part of your project. Our various solder wires solder well into these plated through hole pads. Hook-Up Wire - Assortment (Stranded, 22 AWG) <https://www.sparkfun.com/products/11375> (PRT-11375) Hook-Up Wire - Assortment (Solid Core, 22 AWG) <https://www.sparkfun.com/products/11367> (PRT-11367) View the entire wire category on our website here <https://www.sparkfun.com/categories/141> Special notes: Molex polarized connector foot print use with SKU : PRT-08231 with associated crimp pins and housings. 1MM SMD Version SKU: PRT-10208 NOTES ON THE VARIANTS LOCK and LOCK_LONGPADS... This footprint was designed to help hold the alignment of a through-hole component (i.e. 6-pin header) while soldering it into place. You may notice that each hole has been shifted either up or down by 0.005 of an inch from it's more standard position (which is a perfectly straight line). This slight alteration caused the pins (the squares in the middle) to touch the edges of the holes. Because they are alternating, it causes a "brace" to hold the component in place. 0.005 has proven to be the perfect amount of "off-center" position when using our standard breakaway headers. Although looks a little odd when you look at the bare footprint, once you have a header in there, the alteration is very hard to notice. Also,if you push a header all the way into place, it is covered up entirely on the bottom side.
J13 J19 = SparkFun-Connectors:CONN_01: Single connection point. Often used as Generic Header-pin footprint for 0.1 inch spaced/style header connections On any of the 0.1 inch spaced packages, you can populate with these: Break Away Headers - Straight <https://www.sparkfun.com/products/116> (PRT-00116) Break Away Male Headers - Right Angle <https://www.sparkfun.com/products/553> (PRT-00553) Female Headers <https://www.sparkfun.com/products/115> (PRT-00115) Break Away Headers - Machine Pin <https://www.sparkfun.com/products/117> (PRT-00117) Break Away Female Headers - Swiss Machine Pin <https://www.sparkfun.com/products/743> (PRT-00743) This device is also useful as a general connection point to wire up your design to another part of your project. Our various solder wires solder well into these plated through hole pads. Hook-Up Wire - Assortment (Stranded, 22 AWG) <https://www.sparkfun.com/products/11375> (PRT-11375) Hook-Up Wire - Assortment (Solid Core, 22 AWG) <https://www.sparkfun.com/products/11367> (PRT-11367) View the entire wire category on our website here <https://www.sparkfun.com/categories/141> Special notes: SMTSO-256-ET is a "flush mount" nut for a 4-40 screw. We mostly use this on specialty testbeds; it is a nice way to connect hardware to your PCB at an adjustable hieght. Also note, the SNAP packages are for using a snappable style connector. We sell a baggie of snaps and they are also used on two LilyPad designs: Snap Assortment - 30 pack (male and female) <https://www.sparkfun.com/products/11347> (DEV-11347) LilyPad Arduino SimpleSnap <https://www.sparkfun.com/products/10941> (DEV-10941) LilyPad SimpleSnap Protoboard <https://www.sparkfun.com/products/10940> (DEV-10940)
J14 = SparkFun-Connectors:I2C_STANDARD: SparkFun I2C Standard Pinout Header SparkFun has standardized on a pinout for all I2C based sensor breakouts. This pinout allows I2C boards to be plugged directly into the headers on Arduino Uno compatible boards, and to be daisy chained easily. Example SparkFun Products: SparkFun Atmospheric Sensor Breakout - BME280 <https://www.sparkfun.com/products/13676> SparkFun Altitude/Pressure Sensor Breakout - MPL3115A2 <https://www.sparkfun.com/products/11084> SparkFun TOF Range Finder Sensor - VL6180 <https://www.sparkfun.com/products/12785>
J17 = SparkFun-Connectors:SIMHOLDER: SIM Cellular Card Socket SMT 6 pin standard connection. SparkFun Products: SIM Socket <https://www.sparkfun.com/products/548> SparkFun Cellular Shield - MG2639 <https://www.sparkfun.com/products/13120> SparkFun SIM Card Socket Breakout <https://www.sparkfun.com/products/573>; PROD_ID: CONN-14097
JP1 = SparkFun-Jumpers:JUMPER-SMT_3_2-NC_TRACE: Normally closed trace jumper (2 of 2 connections) This jumper has a trace between all three pads so they are normally closed (NC). Use a razor knife to open the connection(s). For best results follow the IPC guidelines for cutting traces: Cutout at least 0.063 mm (0.005 in). Remove all loose material to clean up the cut area. Seal the cut with an approved epoxy. Reapply solder to reclose the connection(s).
L1 = New_Parts:INDUCTOR_DNP
L2 = New_Parts:68NH; DIGIKEY_PART: 490-2633-1-ND; MOUSER_PART: 81-LQG15HS68NJ02D; PROD_ID: NDUC-15356
LOGO1 = SparkFun-Aesthetics:SFE_LOGO_NAME_FLAME: SparkFun Font Logo w/ Flame This is the SparkFun full logo. The logo on the schematic will always be the same size; the package variant is the height of the flame part of the logo. Default layer for the logo on the board is tSilk.
LOGO3 = SparkFun-Aesthetics:OSHW-LOGO: Open-Source Hardware (OSHW) Logo This logo indicates the piece of hardware it is found on incorporates a OSHW license and/or adheres to the definition of open source hardware found here: http://freedomdefined.org/OSHW
LOGO5 = SparkFun-Aesthetics:SPECIAL_INSTRUCTIONS: Special Ordering/Production Instructions Alert Symbol for special PCB ordering instructions or unique production process warnings. Ordering Instructions Production Instructions Types of information that should be added to box: Copper weight Soldermask color Silk color PCB thickness Number of layers PCB Standard: 1.6mm FR4 1 oz copper immersion silver plating red soldermask white silkscreen Types of information that should be added to box: Special wash requirements Depaneling instructions Humidification Glue curing Default text settings: 0.07 inch 9% ratio 50% line distance
MEAS = SparkFun-Jumpers:JUMPER-COMBO_2_NC_TRACE
Q1-Q4 Q7-Q9 = SparkFun-DiscreteSemi:MOSFET-NCH: N-channel MOSFETs Voltage controlled devices that allow control of high current outputs. SparkFun Products: SparkFun OpenScale <https://www.sparkfun.com/products/13261> SparkFun Digital Sandbox <https://www.sparkfun.com/products/12651> SparkFun Monster Moto Shield <https://www.sparkfun.com/products/10182> SparkFun MOSFET Power Controller <https://www.sparkfun.com/products/11214>; PROD_ID: TRANS-11151
Q5 = SparkFun-DiscreteSemi:MOSFET-NCH: N-channel MOSFETs Voltage controlled devices that allow control of high current outputs. SparkFun Products: SparkFun OpenScale <https://www.sparkfun.com/products/13261> SparkFun Digital Sandbox <https://www.sparkfun.com/products/12651> SparkFun Monster Moto Shield <https://www.sparkfun.com/products/10182> SparkFun MOSFET Power Controller <https://www.sparkfun.com/products/11214>; PROD_ID: TRANS-14399
R1 R4 R29 R30 = SparkFun-Resistors:2.2KOHM: 2.2kΩ resistor A resistor is a passive two-terminal electrical component that implements electrical resistance as a circuit element. Resistors act to reduce current flow, and, at the same time, act to lower voltage levels within circuits. - Wikipedia; PROD_ID: RES-08272
R2 R3 R7-R10 R16 = SparkFun-Resistors:5.1KOHM; PROD_ID: RES-12083
R5 R15 R18 R25 R38 R39 R45 = SparkFun-Resistors:100KOHM: 100kΩ resistor A resistor is a passive two-terminal electrical component that implements electrical resistance as a circuit element. Resistors act to reduce current flow, and, at the same time, act to lower voltage levels within circuits. - Wikipedia; PROD_ID: RES-07828
R6 R12 R14 = SparkFun-Resistors:4.7KOHM: 4.7kΩ resistor A resistor is a passive two-terminal electrical component that implements electrical resistance as a circuit element. Resistors act to reduce current flow, and, at the same time, act to lower voltage levels within circuits. - Wikipedia; PROD_ID: RES-07857
R11 R13 R27 R28 R32 R34 R42 R43 = SparkFun-Resistors:1KOHM: 1kΩ resistor A resistor is a passive two-terminal electrical component that implements electrical resistance as a circuit element. Resistors act to reduce current flow, and, at the same time, act to lower voltage levels within circuits. - Wikipedia; PROD_ID: RES-07856
R23 = SparkFun-Resistors:10KOHM: 10kΩ resistor A resistor is a passive two-terminal electrical component that implements electrical resistance as a circuit element. Resistors act to reduce current flow, and, at the same time, act to lower voltage levels within circuits. - Wikipedia; PROD_ID: RES-00824
R24 = SparkFun-Resistors:10OHM: 10Ω resistor A resistor is a passive two-terminal electrical component that implements electrical resistance as a circuit element. Resistors act to reduce current flow, and, at the same time, act to lower voltage levels within circuits. - Wikipedia; PROD_ID: RES-12581
R26 = SparkFun-Resistors:200KOHM: 200kΩ resistor A resistor is a passive two-terminal electrical component that implements electrical resistance as a circuit element. Resistors act to reduce current flow, and, at the same time, act to lower voltage levels within circuits. - Wikipedia; PROD_ID: RES-09385
R31 R36 R37 = SparkFun-Resistors:0OHM: 0Ω resistor A resistor is a passive two-terminal electrical component that implements electrical resistance as a circuit element. Resistors act to reduce current flow, and, at the same time, act to lower voltage levels within circuits. - Wikipedia; PROD_ID: RES-08609
R33 = SparkFun-Resistors:100OHM: 100Ω resistor A resistor is a passive two-terminal electrical component that implements electrical resistance as a circuit element. Resistors act to reduce current flow, and, at the same time, act to lower voltage levels within circuits. - Wikipedia; PROD_ID: RES-07863
R35 = SparkFun-Resistors:470OHM: 470Ω resistor A resistor is a passive two-terminal electrical component that implements electrical resistance as a circuit element. Resistors act to reduce current flow, and, at the same time, act to lower voltage levels within circuits. - Wikipedia; PROD_ID: RES-07869
S1 S3 = SparkFun-Switches:MOMENTARY-SWITCH-SPST: Momentary Switch (Pushbutton) - SPST Normally-open (NO) SPST momentary switches (buttons, pushbuttons). Variants PTH-12MM - 12mm square, through-hole Momentary Pushbutton Switch - 12mm Square <https://www.sparkfun.com/products/9190> (COM-09190) PTH-6.0MM, PTH-6.0MM-KIT - 6.0mm square, through-hole Mini Pushbutton Switch <https://www.sparkfun.com/products/97> (COM-00097) KIT package intended for soldering kit's - only one side of pads' copper is exposed. PTH-RIGHT-ANGLE-KIT - Right-angle, through-hole Right Angle Tactile Button <https://www.sparkfun.com/products/10791> - Used on SparkFun BigTime Watch Kit <https://www.sparkfun.com/products/11734> SMD-12MM - 12mm square, surface-mount Tactile Button - SMD (12mm) <https://www.sparkfun.com/products/12993> (COM-12993) Used on SparkFun PicoBoard <https://www.sparkfun.com/products/11888> SMD-4.5MM - 4.5mm Square Trackball Switch Used on SparkFun Blackberry Trackballer Breakout <https://www.sparkfun.com/products/13169> SMD-4.6MMX2.8MM - 4.60mm x 2.80mm, surface mount Used on SparkFun SAMD21 Mini Breakout <https://www.sparkfun.com/products/13664> SMD-5.2MM, SMD-5.2-REDUNDANT - 5.2mm square, surface-mount Mini Pushbutton Switch - SMD <https://www.sparkfun.com/products/8720> (COM-08720) Used on Arduino Pro Mini <https://www.sparkfun.com/products/11114> REDUNDANT package connects both switch circuits together SMD-6.0X3.5MM - 6.0 x 3.5mm, surface mount Momentary Reset Switch SMD <https://www.sparkfun.com/products/8229> (COM-08229) SMD-6.2MM-TALL - 6.2mm square, surface mount Tactile Button - SMD (6mm) <https://www.sparkfun.com/products/12992> Used on SparkFun Digital Sandbox <https://www.sparkfun.com/products/12651> SMD-RIGHT-ANGLE - Right-angle, surface mount Used on SparkFun Block for Intel® Edison - Arduino <https://www.sparkfun.com/products/13036>; PROD_ID: SWCH-14139
SERIAL = SparkFun-Connectors:CONN_10: Multi connection point. Often used as Generic Header-pin footprint for 0.1 inch spaced/style header connections On any of the 0.1 inch spaced packages, you can populate with these: Break Away Headers - Straight <https://www.sparkfun.com/products/116> (PRT-00116) Break Away Male Headers - Right Angle <https://www.sparkfun.com/products/553> (PRT-00553) Female Headers <https://www.sparkfun.com/products/115> (PRT-00115) Break Away Headers - Machine Pin <https://www.sparkfun.com/products/117> (PRT-00117) Break Away Female Headers - Swiss Machine Pin <https://www.sparkfun.com/products/743> (PRT-00743) Arduino Stackable Header - 10 Pin <https://www.sparkfun.com/products/11376> (PRT-11376) For SCREWTERMINALS and SPRING TERMINALS visit here: Screw Terimnals on SparkFun.com <https://www.sparkfun.com/search/results?term=Screw+Terminals> (5mm/3.5mm/2.54mm spacing) This device is also useful as a general connection point to wire up your design to another part of your project. Our various solder wires solder well into these plated through hole pads. Hook-Up Wire - Assortment (Stranded, 22 AWG) <https://www.sparkfun.com/products/11375> (PRT-11375) Hook-Up Wire - Assortment (Solid Core, 22 AWG) <https://www.sparkfun.com/products/11367> (PRT-11367) View the entire wire category on our website here <https://www.sparkfun.com/categories/141> Special notes: Molex polarized connector foot print use with SKU : PRT-08231 with associated crimp pins and housings. 1MM SMD Version SKU: PRT-10208 NOTES ON THE VARIANTS LOCK and LOCK_LONGPADS... This footprint was designed to help hold the alignment of a through-hole component (i.e. 6-pin header) while soldering it into place. You may notice that each hole has been shifted either up or down by 0.005 of an inch from it's more standard position (which is a perfectly straight line). This slight alteration caused the pins (the squares in the middle) to touch the edges of the holes. Because they are alternating, it causes a "brace" to hold the component in place. 0.005 has proven to be the perfect amount of "off-center" position when using our standard breakaway headers. Although looks a little odd when you look at the bare footprint, once you have a header in there, the alteration is very hard to notice. Also,if you push a header all the way into place, it is covered up entirely on the bottom side.
TP1-TP4 TP9 TP10 TP14-TP17 TP22 = SparkFun-Connectors:TEST-POINT: SparkFun Test Points Bare copper test points for troubleshooting or In-Circuit-Testing. These are used by our Production team for verifying production board runs using pogo-pins on test beds. SparkFun Products: SparkFun LSM9DS1 Breakout <https://www.sparkfun.com/products/13284> SparkFun PSOC <https://www.sparkfun.com/products/13714> SparkFun Load Cell Amplifier <https://www.sparkfun.com/products/13879>
U1 = SARA_R5:SARA-R510M8S; PROD_ID: IC-15573
U2 = SparkFun-IC-Comms:CH340C; PROD_ID: IC-14038
U3 = SparkFun-IC-Power:V_REG_AP2112: AP2112 - 600mA CMOS LDO Regulator w/ Enable The AP2112 is CMOS process low dropout linear regulator with enable function, the regulator delivers a guaranteed 600mA (min.) continuous load current. Features Output Voltage Accuracy: ±1.5% Output Current: 600mA (Min.) Foldback Short Current Protection: 50mA Enable Function to Turn ON/OFF VOUT Low Dropout Voltage (3.3V): 250mV (Typ.) @IOUT=600mA Excellent Load Regulation: 0.2%/A (Typ.) Excellent Line Regulation: 0.02%/V (Typ.) Low Quiescent Current: 55μA (Typ.) Low Standby Current: 0.01μA (Typ.) Low Output Noise: 50μVRMS PSRR: 100Hz -65dB, 1kHz -65dB OTSD Protection Stable with 1.0μF Flexible Cap: Ceramic, Tantalum and Aluminum Electrolytic Operation Temperature Range: -40°C to 85°C ESD: MM 400V, HBM 4000V; PROD_ID: VREG-12457
U4 = SparkFun-IC-Comms:CH340E; PROD_ID: IC-14135
U5 = SparkFun-IC-Power:AP7361C-33FGE: AP7361C 3.3V LDO Regulator; PROD_ID: VREG-14094
U7 = SparkFun-IC-Comms:PCA9306: Bidirectional I2C level shifter Not compatible with all available part number pinout schemes- DOUBLE CHECK!!! Variants PCA9306DC and PSOP-8 are EOL. If your part has VREF as pin 1 then this is your variant. VSSOP_8PIN is not EOL. Datasheet <https://cdn.sparkfun.com/datasheets/BreakoutBoards/PCA9306DC.pdf> SparkFun Products SparkFun Inventor's Kit for RedBot <https://www.sparkfun.com/products/12649> (ROB-12649) SparkFun RedBot Basic Kit <https://www.sparkfun.com/products/13166> (ROB-13166) SparkFun Level Translator Breakout - PCA9306 <https://www.sparkfun.com/products/11955> (BOB-11955) SparkFun Block for Intel Edison - ADC <https://www.sparkfun.com/products/13770> (DEV-13770) SparkFun Block for Intel® Edison - Raspberry Pi B <https://www.sparkfun.com/products/13044> (DEV-13044) SparkFun RedBot Sensor - Accelerometer <https://www.sparkfun.com/products/12589> (SEN-12589); PROD_ID: IC-14450
U8 = SparkFun-IC-Logic:74*1G04: Single Inverter IC NOT GATE INVERTER SNGL 1IN SOT353 Supply: 1.65V to 5.5V Datasheet <http://diodes.com/datasheets/74LVC1G04.pdf> SparkFun Products SparkFun Stepoko <https://www.sparkfun.com/products/13899> (ROB-13899) SparkFun CryptoShield <https://www.sparkfun.com/products/13183> (DEV-13183) SparkFun LogicBlocks Kit <https://www.sparkfun.com/products/11006> (KIT-11006) SparkFun ArduMoto <https://www.sparkfun.com/products/9815> (DEV-09815); PROD_ID: COMP-08268

## Net classes
0 default: width 0 mm, drill 0 mm
1 power: width 0.762 mm